# Altium schematic sheet H_Bridge.SchDoc
size A4
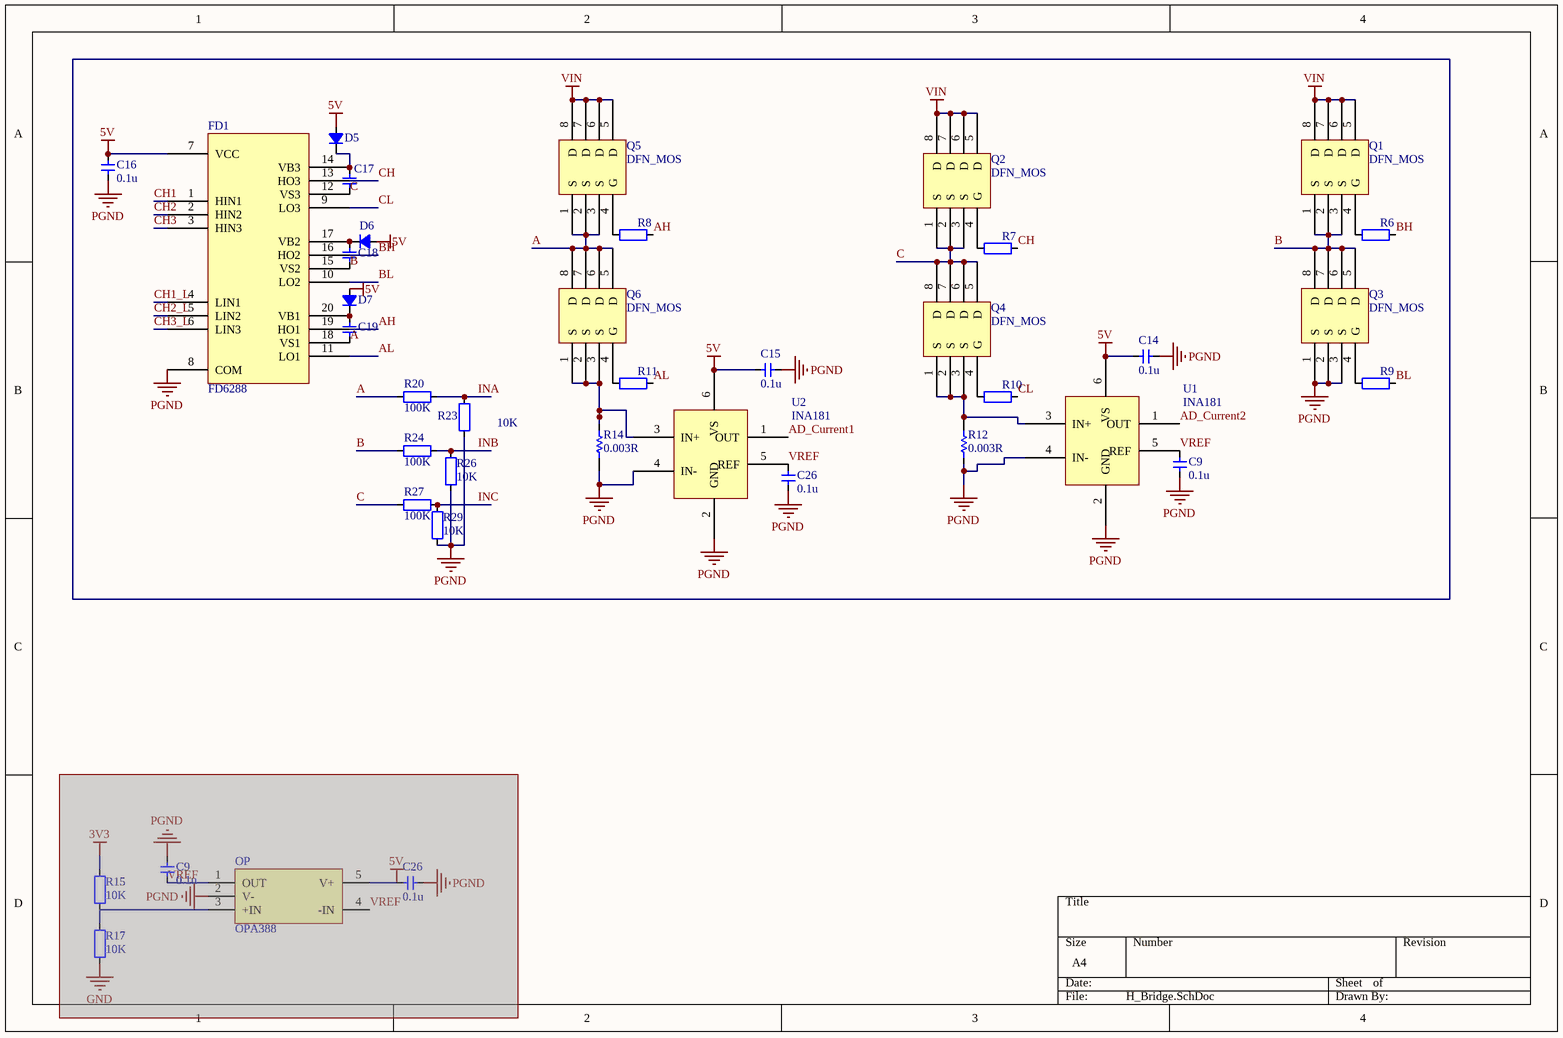
[diagram p0: H_Bridge.SchDoc]

## Parts
(Parts that share a designator on the sheet are numbered #1, #2 ... from top to bottom, then left to right.)
C9#1  value 0.1u  [CAP_0603]  (hidden comment: Cap_0603)
C9#2  value 0.1u  [CAP_0603]  (hidden comment: Cap_0603)  (masked out: inside a compile mask, not in the netlist)
C14  value 0.1u  [CAP_0603]  (hidden comment: Cap_0603)
C15  value 0.1u  [CAP_0603]  (hidden comment: Cap_0603)
C16  value 0.1u  [CAP_0603]  (hidden comment: Cap_0603)
C17  Cap_0603  [CAP_0603]  (value not drawn)
C18  Cap_0603  [CAP_0603]  (value not drawn)
C19  Cap_0603  [CAP_0603]  (value not drawn)
C26#1  value 0.1u  [CAP_0603]  (hidden comment: Cap_0603)
C26#2  value 0.1u  [CAP_0603]  (hidden comment: Cap_0603)  (masked out: inside a compile mask, not in the netlist)
D5  D_0805  [LED_0805_YELLOW]  (value not drawn)
D6  D_0805  [LED_0805_YELLOW]  (value not drawn)
D7  D_0805  [LED_0805_YELLOW]  (value not drawn)
FD1  FD6288  [TSSOP_E170_P0.65_20]
OP  OPA388  [SOT23-5]  (masked out: inside a compile mask, not in the netlist)
Q1  DFN_MOS  [DFN3X3X8]
Q2  DFN_MOS  [DFN3X3X8]
Q3  DFN_MOS  [DFN3X3X8]
Q4  DFN_MOS  [DFN3X3X8]
Q5  DFN_MOS  [DFN3X3X8]
Q6  DFN_MOS  [DFN3X3X8]
R6  Res_0603  [RES_0603]  (value not drawn)
R7  Res_0603  [RES_0603]  (value not drawn)
R8  Res_0603  [RES_0603]  (value not drawn)
R9  Res_0603  [RES_0603]  (value not drawn)
R10  Res_0603  [RES_0603]  (value not drawn)
R11  Res_0603  [RES_0603]  (value not drawn)
R12  value 0.003R  [RES-1206]  (hidden comment: Res1)
R14  value 0.003R  [RES-1206]  (hidden comment: Res1)
R15  value 10K  [RES_0603]  (hidden comment: Res_0603)  (masked out: inside a compile mask, not in the netlist)
R17  value 10K  [RES_0603]  (hidden comment: Res_0603)  (masked out: inside a compile mask, not in the netlist)
R20  value 100K  [RES_0603]  (hidden comment: Res_0603)
R23  value 10K  [RES_0603]  (hidden comment: Res_0603)
R24  value 100K  [RES_0603]  (hidden comment: Res_0603)
R26  value 10K  [RES_0603]  (hidden comment: Res_0603)
R27  value 100K  [RES_0603]  (hidden comment: Res_0603)
R29  value 10K  [RES_0603]  (hidden comment: Res_0603)
U1  INA181  [SOT23-6]
U2  INA181  [SOT23-6]

## Nets
5V: C14.2 C15.2 C16.2 D5.1(A) D6.1(A) D7.1(A) FD1.7(VCC) U1.6(VS) U2.6(VS)
PGND: C9#1.2 C14.1 C15.1 C16.1 C26#1.2 FD1.8(COM) Q3.1(S) Q3.2(S) Q3.3(S) R12.1 R14.1 R23.1 R26.1 R29.1 U1.2(GND) U1.4(IN-) U2.2(GND) U2.4(IN-)
VIN: Q1.5(D) Q1.6(D) Q1.7(D) Q1.8(D) Q2.5(D) Q2.6(D) Q2.7(D) Q2.8(D) Q5.5(D) Q5.6(D) Q5.7(D) Q5.8(D)
A: C19.2 FD1.18(VS1) Q5.1(S) Q5.2(S) Q5.3(S) Q6.5(D) Q6.6(D) Q6.7(D) Q6.8(D) R20.1
AD_Current1: U2.1(OUT)
AD_Current2: U1.1(OUT)
AH: FD1.19(HO1) R8.2
AL: FD1.11(LO1) R11.2
B: C18.2 FD1.15(VS2) Q1.1(S) Q1.2(S) Q1.3(S) Q3.5(D) Q3.6(D) Q3.7(D) Q3.8(D) R24.1
BH: FD1.16(HO2) R6.2
BL: FD1.10(LO2) R9.2
C: C17.2 FD1.12(VS3) Q2.1(S) Q2.2(S) Q2.3(S) Q4.5(D) Q4.6(D) Q4.7(D) Q4.8(D) R27.1
CH: FD1.13(HO3) R7.2
CH1: FD1.1(HIN1)
CH1_L: FD1.4(LIN1)
CH2: FD1.2(HIN2)
CH2_L: FD1.5(LIN2)
CH3: FD1.3(HIN3)
CH3_L: FD1.6(LIN3)
CL: FD1.9(LO3) R10.2
INA: R20.2 R23.2
INB: R24.2 R26.2
INC: R27.2 R29.2
VREF: C9#1.1 C26#1.1 U1.5(REF) U2.5(REF)
NetC17_1: C17.1 D5.2(K) FD1.14(VB3)
NetC18_1: C18.1 D6.2(K) FD1.17(VB2)
NetC19_1: C19.1 D7.2(K) FD1.20(VB1)
NetQ1_4: Q1.4(G) R6.1
NetQ2_4: Q2.4(G) R7.1
NetQ3_4: Q3.4(G) R9.1
NetQ4_1: Q4.1(S) Q4.2(S) Q4.3(S) R12.2 U1.3(IN+)
NetQ4_4: Q4.4(G) R10.1
NetQ5_4: Q5.4(G) R8.1
NetQ6_1: Q6.1(S) Q6.2(S) Q6.3(S) R14.2 U2.3(IN+)
NetQ6_4: Q6.4(G) R11.1

## Library data of the parts
C9#1 C9#2 C14-C16 C26#1 C26#2 = Cap_0603: Capacitor
C17-C19 = Cap_0603: Capacitor; Value: 1u
OP = OPA188: OP
R6-R11 = Res_0603: Resistor; Value: 10R
R12 R14 = Res1: Resistor; Published: 8-Jun-2000; LatestRevisionDate: 17-Jul-2002; LatestRevisionNote: Re-released for DXP Platform.; PackageReference: AXIAL-0.3; Publisher: Altium Limited
R15 R17 R20 R23 R24 R26 R27 R29 = Res_0603: Resistor